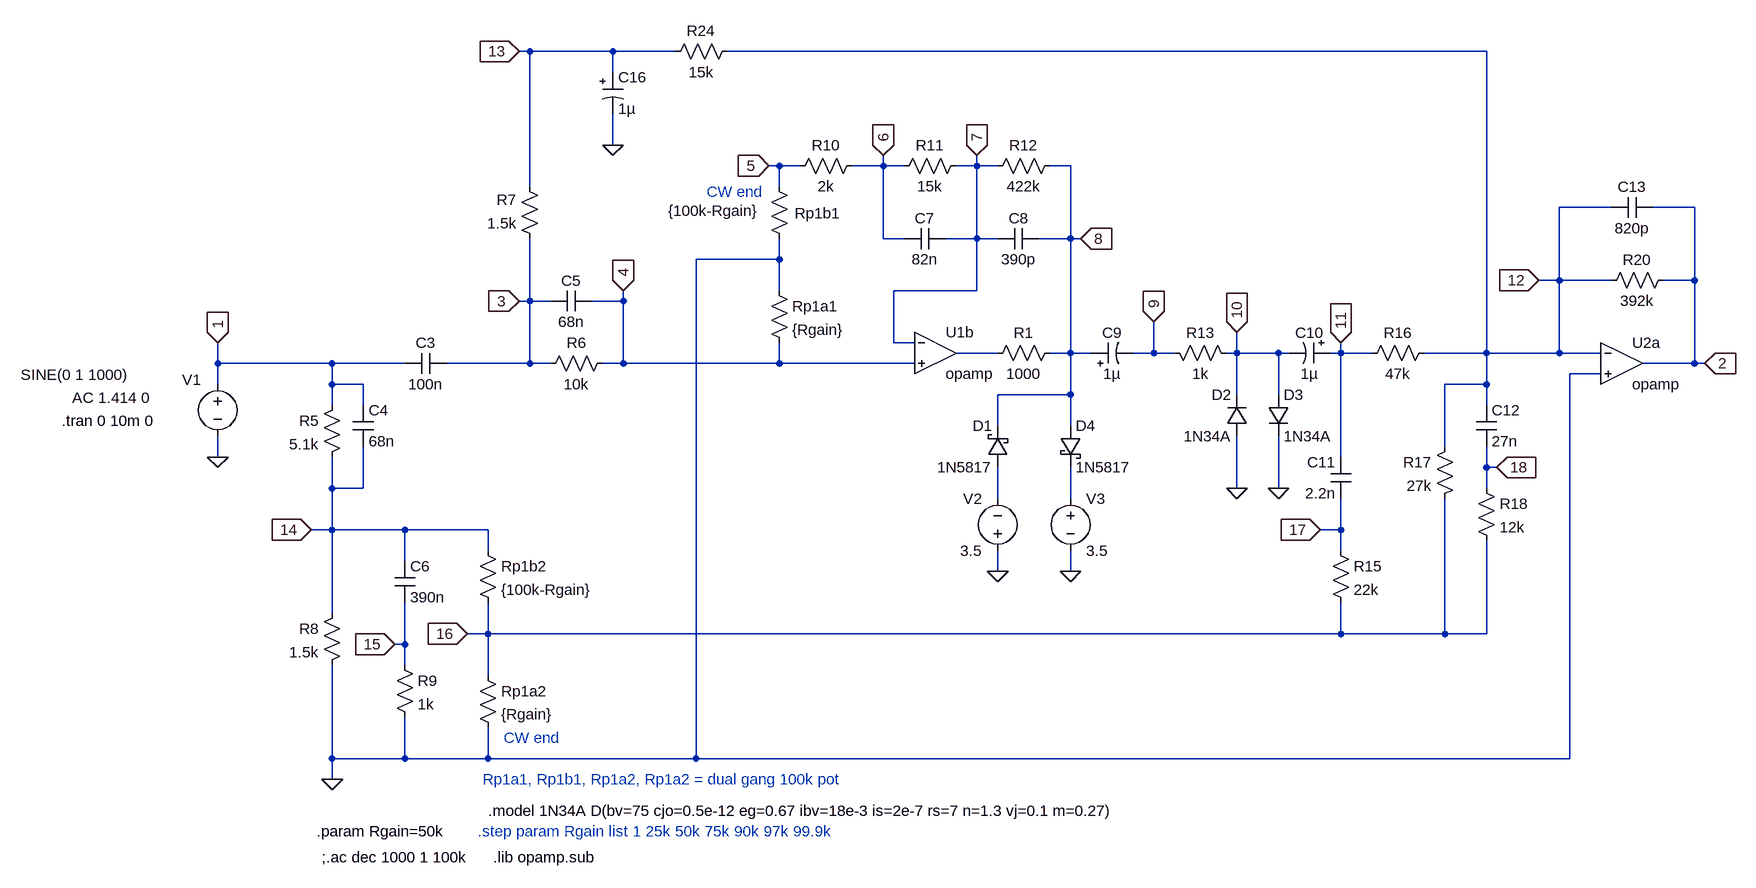
[diagram p0: schematic Klon-Centaur_combined_path_v1.asc]
Klon-Centaur_combined_path_v1.asc, the LTspice schematic file:
Version 4
SHEET 1 4496 5064
WIRE 96 2080 80 2080
WIRE 224 2080 96 2080
WIRE 320 2080 224 2080
WIRE 1568 2080 400 2080
WIRE 224 2112 224 2080
WIRE 224 2224 224 2176
WIRE 480 2256 464 2256
WIRE 512 2256 480 2256
WIRE 640 2256 640 2240
WIRE 640 2256 592 2256
WIRE 672 2256 640 2256
WIRE 784 2256 784 2240
WIRE 784 2256 752 2256
WIRE 816 2256 784 2256
WIRE 928 2256 896 2256
WIRE 96 2288 96 2080
WIRE 480 2288 480 2256
WIRE 1760 2320 1680 2320
WIRE 1888 2320 1824 2320
WIRE 640 2368 640 2256
WIRE 672 2368 640 2368
WIRE 784 2368 784 2256
WIRE 784 2368 736 2368
WIRE 816 2368 784 2368
WIRE 928 2368 928 2256
WIRE 928 2368 880 2368
WIRE 944 2368 928 2368
WIRE 480 2400 480 2368
WIRE 480 2400 352 2400
WIRE 1680 2432 1680 2320
WIRE 1680 2432 1648 2432
WIRE 1760 2432 1680 2432
WIRE 1888 2432 1888 2320
WIRE 1888 2432 1840 2432
WIRE 480 2448 480 2400
WIRE 784 2448 784 2368
WIRE 784 2448 656 2448
WIRE 96 2464 96 2368
WIRE 96 2464 80 2464
WIRE 128 2464 96 2464
WIRE 240 2464 240 2448
WIRE 240 2464 192 2464
WIRE 656 2528 656 2448
WIRE 688 2528 656 2528
WIRE 816 2544 752 2544
WIRE 928 2544 928 2368
WIRE 928 2544 896 2544
WIRE 960 2544 928 2544
WIRE 1056 2544 1056 2496
WIRE 1056 2544 1024 2544
WIRE 1088 2544 1056 2544
WIRE 1184 2544 1184 2512
WIRE 1184 2544 1168 2544
WIRE 1248 2544 1184 2544
WIRE 1264 2544 1248 2544
WIRE 1344 2544 1344 2528
WIRE 1344 2544 1328 2544
WIRE 1392 2544 1344 2544
WIRE 1568 2544 1568 2080
WIRE 1568 2544 1472 2544
WIRE 1680 2544 1680 2432
WIRE 1680 2544 1568 2544
WIRE 1744 2544 1680 2544
WIRE -384 2560 -384 2528
WIRE -208 2560 -384 2560
WIRE -96 2560 -208 2560
WIRE 96 2560 96 2464
WIRE 96 2560 -32 2560
WIRE 128 2560 96 2560
WIRE 240 2560 240 2464
WIRE 240 2560 208 2560
WIRE 480 2560 480 2528
WIRE 480 2560 240 2560
WIRE 688 2560 480 2560
WIRE 1888 2560 1888 2432
WIRE 1888 2560 1808 2560
WIRE 1904 2560 1888 2560
WIRE 1744 2576 1696 2576
WIRE -384 2592 -384 2560
WIRE -208 2592 -208 2560
WIRE -160 2592 -208 2592
WIRE 1568 2592 1568 2544
WIRE 1568 2592 1504 2592
WIRE 928 2608 928 2544
WIRE 928 2608 816 2608
WIRE 1184 2608 1184 2544
WIRE 1248 2608 1248 2544
WIRE -208 2624 -208 2592
WIRE -160 2624 -160 2592
WIRE 1568 2624 1568 2592
WIRE 816 2656 816 2608
WIRE 928 2656 928 2608
WIRE 1504 2688 1504 2592
WIRE -384 2704 -384 2672
WIRE 1344 2704 1344 2544
WIRE 1568 2720 1568 2688
WIRE 1584 2720 1568 2720
WIRE -208 2752 -208 2704
WIRE -160 2752 -160 2688
WIRE -160 2752 -208 2752
WIRE 1184 2752 1184 2672
WIRE 1248 2752 1248 2672
WIRE 1568 2752 1568 2720
WIRE 816 2768 816 2720
WIRE 928 2768 928 2720
WIRE -208 2816 -208 2752
WIRE -208 2816 -240 2816
WIRE -96 2816 -208 2816
WIRE 32 2816 -96 2816
WIRE 1344 2816 1344 2768
WIRE 1344 2816 1312 2816
WIRE 32 2848 32 2816
WIRE 1344 2848 1344 2816
WIRE -96 2864 -96 2816
WIRE 816 2880 816 2848
WIRE 928 2880 928 2848
WIRE -208 2944 -208 2816
WIRE 32 2976 32 2928
WIRE 32 2976 0 2976
WIRE 1344 2976 1344 2928
WIRE 1344 2976 32 2976
WIRE 1504 2976 1504 2768
WIRE 1504 2976 1344 2976
WIRE 1568 2976 1568 2832
WIRE 1568 2976 1504 2976
WIRE -96 2992 -96 2928
WIRE -96 2992 -112 2992
WIRE -96 3024 -96 2992
WIRE 32 3040 32 2976
WIRE -208 3168 -208 3024
WIRE -96 3168 -96 3104
WIRE -96 3168 -208 3168
WIRE 32 3168 32 3120
WIRE 32 3168 -96 3168
WIRE 352 3168 352 2400
WIRE 352 3168 32 3168
WIRE 1696 3168 1696 2576
WIRE 1696 3168 352 3168
WIRE -208 3200 -208 3168
FLAG -384 2528 1
IOPIN -384 2528 In
FLAG 1248 2752 0
FLAG 1184 2752 0
FLAG 224 2224 0
FLAG 1904 2560 2
IOPIN 1904 2560 In
FLAG -208 3200 0
FLAG -384 2704 0
FLAG 80 2464 3
IOPIN 80 2464 In
FLAG 80 2080 13
IOPIN 80 2080 In
FLAG 240 2448 4
IOPIN 240 2448 In
FLAG 464 2256 5
IOPIN 464 2256 In
FLAG 640 2240 6
IOPIN 640 2240 In
FLAG 784 2240 7
IOPIN 784 2240 In
FLAG 944 2368 8
IOPIN 944 2368 In
FLAG 1056 2496 9
IOPIN 1056 2496 In
FLAG 1184 2512 10
IOPIN 1184 2512 In
FLAG 1344 2528 11
IOPIN 1344 2528 In
FLAG 1312 2816 17
IOPIN 1312 2816 In
FLAG 1584 2720 18
IOPIN 1584 2720 In
FLAG 0 2976 16
IOPIN 0 2976 In
FLAG -112 2992 15
IOPIN -112 2992 In
FLAG -240 2816 14
IOPIN -240 2816 In
FLAG 1648 2432 12
IOPIN 1648 2432 In
FLAG 928 2880 0
FLAG 816 2880 0
SYMBOL voltage -384 2576 R0
WINDOW 0 -55 9 Left 2
WINDOW 123 -224 37 Left 2
WINDOW 39 0 0 Left 0
WINDOW 3 -303 1 Left 2
SYMATTR InstName V1
SYMATTR Value2 AC 1.414 0
SYMATTR Value SINE(0 1 1000)
SYMBOL res -192 2608 M0
SYMATTR InstName R5
SYMATTR Value 5.1k
SYMBOL res -192 2928 M0
SYMATTR InstName R8
SYMATTR Value 1.5k
SYMBOL cap -32 2544 R90
WINDOW 0 0 32 VBottom 2
WINDOW 3 32 32 VTop 2
SYMATTR InstName C3
SYMATTR Value 100n
SYMBOL cap -176 2624 R0
SYMATTR InstName C4
SYMATTR Value 68n
SYMBOL cap -112 2864 R0
SYMATTR InstName C6
SYMATTR Value 390n
SYMBOL res -112 3008 R0
SYMATTR InstName R9
SYMATTR Value 1k
SYMBOL res 224 2544 R90
WINDOW 0 0 56 VBottom 2
WINDOW 3 32 56 VTop 2
SYMATTR InstName R6
SYMATTR Value 10k
SYMBOL cap 192 2448 R90
WINDOW 0 0 32 VBottom 2
WINDOW 3 32 32 VTop 2
SYMATTR InstName C5
SYMATTR Value 68n
SYMBOL res 16 2832 R0
SYMATTR InstName Rp1b2
SYMATTR Value {100k-Rgain}
SYMBOL res 16 3024 R0
SYMATTR InstName Rp1a2
SYMATTR Value {Rgain}
SYMBOL res 464 2272 R0
WINDOW 0 40 57 Left 2
WINDOW 3 -155 53 Left 2
SYMATTR InstName Rp1b1
SYMATTR Value {100k-Rgain}
SYMBOL res 464 2432 R0
SYMATTR InstName Rp1a1
SYMATTR Value {Rgain}
SYMBOL res 608 2240 R90
WINDOW 0 0 56 VBottom 2
WINDOW 3 32 56 VTop 2
SYMATTR InstName R10
SYMATTR Value 2k
SYMBOL res 768 2240 R90
WINDOW 0 0 56 VBottom 2
WINDOW 3 32 56 VTop 2
SYMATTR InstName R11
SYMATTR Value 15k
SYMBOL cap 736 2352 R90
WINDOW 0 0 32 VBottom 2
WINDOW 3 32 32 VTop 2
SYMATTR InstName C7
SYMATTR Value 82n
SYMBOL cap 880 2352 R90
WINDOW 0 0 32 VBottom 2
WINDOW 3 32 32 VTop 2
SYMATTR InstName C8
SYMATTR Value 390p
SYMBOL res 912 2240 R90
WINDOW 0 0 56 VBottom 2
WINDOW 3 32 56 VTop 2
SYMATTR InstName R12
SYMATTR Value 422k
SYMBOL res 1184 2560 M270
WINDOW 0 32 56 VTop 2
WINDOW 3 0 56 VBottom 2
SYMATTR InstName R13
SYMATTR Value 1k
SYMBOL cap 1360 2704 M0
SYMATTR InstName C11
SYMATTR Value 2.2n
SYMBOL res 1328 2832 R0
SYMATTR InstName R15
SYMATTR Value 22k
SYMBOL res 1520 2672 M0
SYMATTR InstName R17
SYMATTR Value 27k
SYMBOL res 1552 2736 R0
SYMATTR InstName R18
SYMATTR Value 12k
SYMBOL cap 1552 2624 R0
SYMATTR InstName C12
SYMATTR Value 27n
SYMBOL res 1488 2528 R90
WINDOW 0 0 56 VBottom 2
WINDOW 3 32 56 VTop 2
SYMATTR InstName R16
SYMATTR Value 47k
SYMBOL res 112 2384 R180
WINDOW 0 36 76 Left 2
WINDOW 3 36 40 Left 2
SYMATTR InstName R7
SYMATTR Value 1.5k
SYMBOL res 416 2064 R90
WINDOW 0 0 56 VBottom 2
WINDOW 3 32 56 VTop 2
SYMATTR InstName R24
SYMATTR Value 15k
SYMBOL res 1856 2416 R90
WINDOW 0 0 56 VBottom 2
WINDOW 3 32 56 VTop 2
SYMATTR InstName R20
SYMATTR Value 392k
SYMBOL cap 1824 2304 R90
WINDOW 0 0 32 VBottom 2
WINDOW 3 32 32 VTop 2
SYMATTR InstName C13
SYMATTR Value 820p
SYMBOL OpAmps\\opamp 720 2480 R0
SYMATTR InstName U1b
SYMBOL OpAmps\\opamp 1776 2496 R0
SYMATTR InstName U2a
SYMBOL diode 1200 2672 R180
WINDOW 0 24 64 Left 2
WINDOW 3 24 0 Left 2
SYMATTR InstName D2
SYMATTR Value 1N34A
SYMBOL diode 1232 2608 R0
SYMATTR InstName D3
SYMATTR Value 1N34A
SYMBOL polcap 208 2112 R0
SYMATTR InstName C16
SYMATTR Value 1µ
SYMBOL polcap 960 2560 R270
WINDOW 0 32 32 VTop 2
WINDOW 3 0 32 VBottom 2
SYMATTR InstName C9
SYMATTR Value 1µ
SYMBOL polcap 1328 2528 R90
WINDOW 0 0 32 VBottom 2
WINDOW 3 32 32 VTop 2
SYMATTR InstName C10
SYMATTR Value 1µ
SYMBOL voltage 816 2864 R180
WINDOW 0 24 96 Left 2
WINDOW 3 24 16 Left 2
WINDOW 123 0 0 Left 0
WINDOW 39 0 0 Left 0
SYMATTR InstName V2
SYMATTR Value 3.5
SYMBOL voltage 928 2752 R0
WINDOW 123 0 0 Left 0
WINDOW 39 0 0 Left 0
SYMATTR InstName V3
SYMATTR Value 3.5
SYMBOL schottky 832 2720 R180
WINDOW 0 24 64 Left 2
WINDOW 3 24 0 Left 2
SYMATTR InstName D1
SYMATTR Value 1N5817
SYMATTR Description Diode
SYMATTR Type diode
SYMBOL schottky 912 2656 R0
SYMATTR InstName D4
SYMATTR Value 1N5817
SYMATTR Description Diode
SYMATTR Type diode
SYMBOL res 912 2528 R90
WINDOW 0 0 56 VBottom 2
WINDOW 3 32 56 VTop 2
SYMATTR InstName R1
SYMATTR Value 1000
TEXT 40 3320 Left 2 !.lib opamp.sub
TEXT -224 3320 Left 2 !;.ac dec 1000 1 100k
TEXT 368 2296 Left 2 ;CW end
TEXT 56 3136 Left 2 ;CW end
TEXT 16 3280 Left 2 ;.step param Rgain list 1 25k 50k 75k 90k 97k 99.9k
TEXT 24 3200 Left 2 ;Rp1a1, Rp1b1, Rp1a2, Rp1a2 = dual gang 100k pot
TEXT 32 3248 Left 2 !.model 1N34A D(bv=75 cjo=0.5e-12 eg=0.67 ibv=18e-3 is=2e-7 rs=7 n=1.3 vj=0.1 m=0.27)
TEXT -624 2648 Left 2 !.tran 0 10m 0
TEXT -232 3280 Left 2 !.param Rgain=50k

The netlist it stands for:
* Klon-Centaur_combined_path_v1.asc
V1 1 0 SINE(0 1 1000) AC 1.414 0
R5 1 14 5.1k
R8 14 0 1.5k
C3 3 1 100n
C4 1 14 68n
C6 14 15 390n
R9 15 0 1k
R6 4 3 10k
C5 4 3 68n
Rp1b2 14 16 {100k-Rgain}
Rp1a2 16 0 {Rgain}
Rp1b1 5 0 {100k-Rgain}
Rp1a1 0 4 {Rgain}
R10 6 5 2k
R11 7 6 15k
C7 7 6 82n
C8 8 7 390p
R12 8 7 422k
R13 10 9 1k
C11 11 17 2.2n
R15 17 16 22k
R17 12 16 27k
R18 18 16 12k
C12 12 18 27n
R16 12 11 47k
R7 3 13 1.5k
R24 12 13 15k
R20 2 12 392k
C13 2 12 820p
XU1b 7 4 N001 opamp Aol=100K GBW=10Meg  ; pins invin noninvin out
XU2a 12 0 2 opamp Aol=100K GBW=10Meg  ; pins invin noninvin out
D2 0 10 1N34A
D3 10 0 1N34A
C16 13 0 1µ
C9 8 9 1µ
C10 11 10 1µ
V2 0 N002 3.5
V3 N003 0 3.5
D1 N002 8 1N5817
D4 8 N003 1N5817
R1 8 N001 1000
.model D D
.lib standard.dio
.lib opamp.sub
;.ac dec 1000 1 100k
* CW end
* CW end
* .step param Rgain list 1 25k 50k 75k 90k 97k 99.9k
* Rp1a1, Rp1b1, Rp1a2, Rp1a2 = dual gang 100k pot
.model 1N34A D(bv=75 cjo=0.5e-12 eg=0.67 ibv=18e-3 is=2e-7 rs=7 n=1.3 vj=0.1 m=0.27)
.tran 0 10m 0
.param Rgain=50k
.backanno
.end